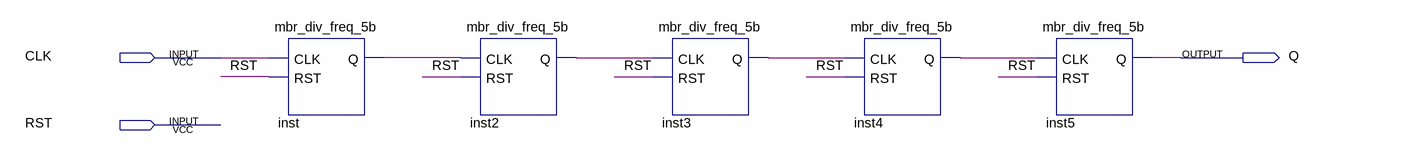
[diagram p0: schematic sheet]
// Quartus schematic mbr_div_freq_25_est.bdf as structural Verilog: 5 symbols, 3 pins
module mbr_div_freq_25_est (
  input  CLK,
  input  RST,
  output Q
);

  wire inst2_q, inst3_q, inst4_q, inst_q;

  mbr_div_freq_5b inst (.CLK(CLK), .RST(RST), .Q(inst_q));
  mbr_div_freq_5b inst2 (.CLK(inst_q), .RST(RST), .Q(inst2_q));
  mbr_div_freq_5b inst3 (.CLK(inst2_q), .RST(RST), .Q(inst3_q));
  mbr_div_freq_5b inst4 (.CLK(inst3_q), .RST(RST), .Q(inst4_q));
  mbr_div_freq_5b inst5 (.CLK(inst4_q), .RST(RST), .Q(Q));
endmodule
